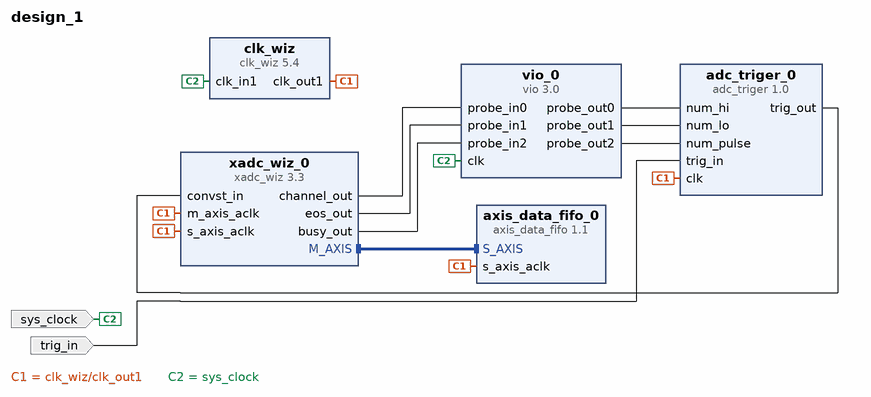
[diagram p0: block diagram of the top level]
# Vivado block design design_1, xc7z010clg400-1, Vivado 2017.2
create_bd_design design_1

create_bd_port -dir I -type clk sys_clock
set_property -dict {CONFIG.FREQ_HZ 125000000 CONFIG.PHASE 0.000} [get_bd_ports sys_clock]
create_bd_port -dir I trig_in

create_bd_cell -type ip -vlnv xilinx.com:ip:xadc_wiz:3.3 xadc_wiz_0
set_property -dict [list \
  CONFIG.INTERFACE_SELECTION ENABLE_DRP \
  CONFIG.TIMING_MODE Event \
  CONFIG.XADC_STARUP_SELECTION channel_sequencer \
  CONFIG.SEQUENCER_MODE Continuous \
  CONFIG.ENABLE_CALIBRATION_AVERAGING false \
  CONFIG.ENABLE_RESET true \
  CONFIG.OT_ALARM false \
  CONFIG.USER_TEMP_ALARM false \
  CONFIG.VCCINT_ALARM false \
  CONFIG.VCCAUX_ALARM false \
  CONFIG.ENABLE_VCCPINT_ALARM false \
  CONFIG.ENABLE_VCCPAUX_ALARM false \
  CONFIG.ENABLE_VCCDDRO_ALARM false \
  CONFIG.SINGLE_CHANNEL_SELECTION TEMPERATURE \
  CONFIG.EXTERNAL_MUX_CHANNEL VP_VN \
  CONFIG.CHANNEL_ENABLE_VP_VN true \
  CONFIG.CHANNEL_ENABLE_VAUXP0_VAUXN0 true \
  CONFIG.CHANNEL_ENABLE_VAUXP1_VAUXN1 true \
  CONFIG.CHANNEL_ENABLE_VAUXP14_VAUXN14 true \
  CONFIG.CHANNEL_ENABLE_VAUXP15_VAUXN15 true \
  CONFIG.ENABLE_AXI4STREAM true \
] [get_bd_cells xadc_wiz_0]
create_bd_cell -type ip -vlnv xilinx.com:user:adc_triger:1.0 adc_triger_0
create_bd_cell -type ip -vlnv xilinx.com:ip:clk_wiz:5.4 clk_wiz
set_property -dict {CONFIG.USE_BOARD_FLOW true CONFIG.CLK_IN1_BOARD_INTERFACE sys_clock} [get_bd_cells clk_wiz]
create_bd_cell -type ip -vlnv xilinx.com:ip:axis_data_fifo:1.1 axis_data_fifo_0
create_bd_cell -type ip -vlnv xilinx.com:ip:vio:3.0 vio_0
set_property -dict [list \
  CONFIG.C_PROBE_OUT2_WIDTH 16 \
  CONFIG.C_PROBE_OUT1_WIDTH 8 \
  CONFIG.C_PROBE_OUT0_WIDTH 8 \
  CONFIG.C_NUM_PROBE_OUT 3 \
  CONFIG.C_NUM_PROBE_IN 3 \
] [get_bd_cells vio_0]

# ---- connections ----

connect_bd_intf_net [get_bd_intf_pins xadc_wiz_0/M_AXIS] [get_bd_intf_pins axis_data_fifo_0/S_AXIS]
connect_bd_net [get_bd_pins clk_wiz/clk_out1] \
  [get_bd_pins xadc_wiz_0/s_axis_aclk] [get_bd_pins adc_triger_0/clk] [get_bd_pins axis_data_fifo_0/s_axis_aclk] \
  [get_bd_pins xadc_wiz_0/m_axis_aclk]
connect_bd_net [get_bd_pins adc_triger_0/trig_out] [get_bd_pins xadc_wiz_0/convst_in]
connect_bd_net [get_bd_ports sys_clock] [get_bd_pins clk_wiz/clk_in1] [get_bd_pins vio_0/clk]
connect_bd_net [get_bd_pins vio_0/probe_out0] [get_bd_pins adc_triger_0/num_hi]
connect_bd_net [get_bd_pins vio_0/probe_out1] [get_bd_pins adc_triger_0/num_lo]
connect_bd_net [get_bd_pins vio_0/probe_out2] [get_bd_pins adc_triger_0/num_pulse]
connect_bd_net [get_bd_pins xadc_wiz_0/channel_out] [get_bd_pins vio_0/probe_in0]
connect_bd_net [get_bd_pins xadc_wiz_0/eos_out] [get_bd_pins vio_0/probe_in1]
connect_bd_net [get_bd_pins xadc_wiz_0/busy_out] [get_bd_pins vio_0/probe_in2]
connect_bd_net [get_bd_ports trig_in] [get_bd_pins adc_triger_0/trig_in]

validate_bd_design
save_bd_design
